# Altium project PCB_Project.PrjPcb
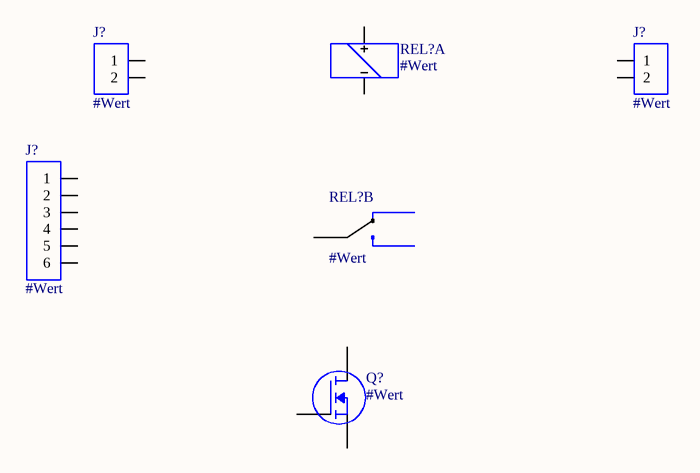
[diagram p0: Sheet1.SchDoc]
1 sheet, 6 parts. Net scope: global (net labels, ports and power ports of the same name join across sheets).

## Sheet Sheet1.SchDoc
size A4; SheetNumber: 1; SheetTotal: 1

### Parts
(Parts that share a designator on the sheet are numbered #1, #2 ... from top to bottom, then left to right.)
J?#1  #Wert  [SIP-2]
J?#2  #Wert  [SIP-2]
J?#3  #Wert  [SIP-6]
Q?  #Wert  [SOT-23]
REL?#1  #Wert  [Rel_THT_1x 2]  (part A of 2)
REL?#2  #Wert  [Rel_THT_1x 2]  (part B of 2)

### Nets

Not connected (* = marked no-connect by the designer): J?#1 1 2; J?#2 1 2; J?#3 1 2 3 4 5 6; Q? D G S; REL?#1 1(+) 2; REL?#2 3 4(NO) 5

### Library data of the parts
J?#1 J?#2 = J_THT_CON2: Stecker
J?#3 = J_THT_CON6: Stecker
Q? = Q_SMD_MOSFET-N-Kanal: N-Kanal MOSFET; MP: IRFZ44NPBF; MF: Infineon; Check_prices: https://www.snapeda.com/parts/IRFZ44NPBF/Infineon+Technologies/view-part/?ref=eda; Package: TO-220-3 Infineon; SnapEDA_Link: https://www.snapeda.com/parts/IRFZ44NPBF/Infineon+Technologies/view-part/?ref=snap; Value: *; Digi-Key_Part_Number: IRFZ44NPBF-ND; Purchase-URL: https://pricing.snapeda.com/search/part/IRFZ44NPBF/?ref=eda
REL?#1 REL?#2 = Rel_THT_1x2: Relais 1 Öffner, 1 Schließer